# Altium schematic sheet InterfacesA_USBFTDI.SchDoc
size A4; DocumentNumber: 9; SheetNumber: 9
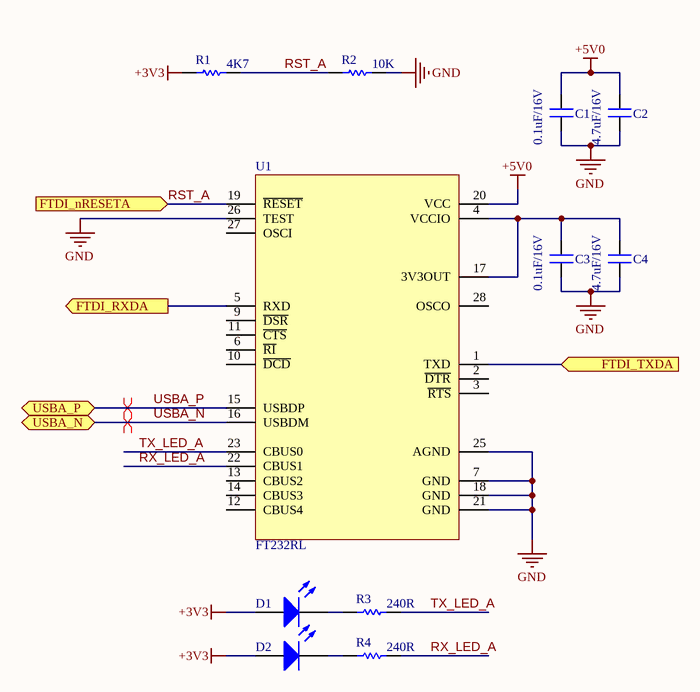
[diagram p0: InterfacesA_USBFTDI.SchDoc]

## Parts
C1  value 0.1uF/16V  [CAP_0805]  (hidden comment: CAP_0805)
C2  value 4.7uF/16V  [CAP_0805]  (hidden comment: CAP_0805)
C3  value 0.1uF/16V  [CAP_0805]  (hidden comment: CAP_0805)
C4  value 4.7uF/16V  [CAP_0805]  (hidden comment: CAP_0805)
D1  LED_0603  [LED_0603]  (value not drawn)
D2  LED_0603  [LED_0603]  (value not drawn)
R1  value 4K7  [RES_0805]  (hidden comment: RES_0805)
R2  value 10K  [RES_0805]  (hidden comment: RES_0805)
R3  value 240R  [RES_0805]  (hidden comment: RES_0805)
R4  value 240R  [RES_0805]  (hidden comment: RES_0805)
U1  FT232RL  [FT232RL]

## Ports
FTDI_nRESETA (in), FTDI_RXDA (out), FTDI_TXDA (in), USBA_N (bidir), USBA_P (bidir)

## Nets
+3V3: D1.1(A) D2.1(A) R1.1
+5V0: C1.1 C2.2 U1.20(VCC)
GND: C1.2 C2.1 C3.2 C4.1 R2.2 U1.7(GND) U1.18(GND) U1.21(GND) U1.25(AGND) U1.26(TEST)
FTDI_RXDA: U1.5(RXD) ; port FTDI_RXDA
FTDI_TXDA: U1.1(TXD) ; port FTDI_TXDA
RST_A: R1.2 R2.1 U1.19(~{RESET}) ; port FTDI_nRESETA
RX_LED_A: R4.2 U1.22(CBUS1)
TX_LED_A: R3.2 U1.23(CBUS0)
USBA_N: U1.16(USBDM) ; port USBA_N
USBA_P: U1.15(USBDP) ; port USBA_P
NetC3_1: C3.1 C4.2 U1.4(VCCIO) U1.17(3V3OUT)
NetD1_2: D1.2(K) R3.1
NetD2_2: D2.2(K) R4.1

Not connected (* = marked no-connect by the designer): U1 2(~{DTR}) 3(~{RTS}) 6(~{RI}) 9(~{DSR}) 10(~{DCD}) 11(~{CTS}) 12(CBUS4) 13(CBUS2) 14(CBUS3) 27(OSCI) 28(OSCO)

## Layout directives
differential pair: USBA_N, USBA_P

## Notes on the sheet
- Title
- Size:
- Date:
- A4
- Number:
- Time:
- Revision:
- Sheet
- of
- File:

## Library data of the parts
U1 = FT232RL: USB Bridge, USB to UART USB 2.0 UART Interface 28-SSOP; MP: FT232RL-REEL; MF: FTDI,; Digi-Key_Purchase_URL: https://www.digikey.com/product-detail/en/ftdi-future-technology-devices-international-ltd/FT232RL-REEL/768-1007-1-ND/1836402?utm_source=snapeda&utm_medium=aggregator&utm_campaign=symbol; Digi-Key_Part_Number: 768-1007-1-ND; Package: SSOP-28 FTDI; Value: *; SnapEDA_Link: https://www.snapeda.com/parts/FT232RL-REEL/FTDI%2C%20Future%20Technology%20Devices%20International%20Ltd/view-part/45427/?ref=snap